# EasyEDA Pro project ProPrj_HEMY 2.0_2025-04-23.epro, schematic Schematic3_2
Board Name: DC & USB Dovetail; Create Date: 2025-03-09; Page Name: P1; Project Name: AstraNode; Schematic Name: Schematic3_2; Update Date: 2025-03-09; Company: EasyEDA.com; Page Size: A4; Version: V1.0
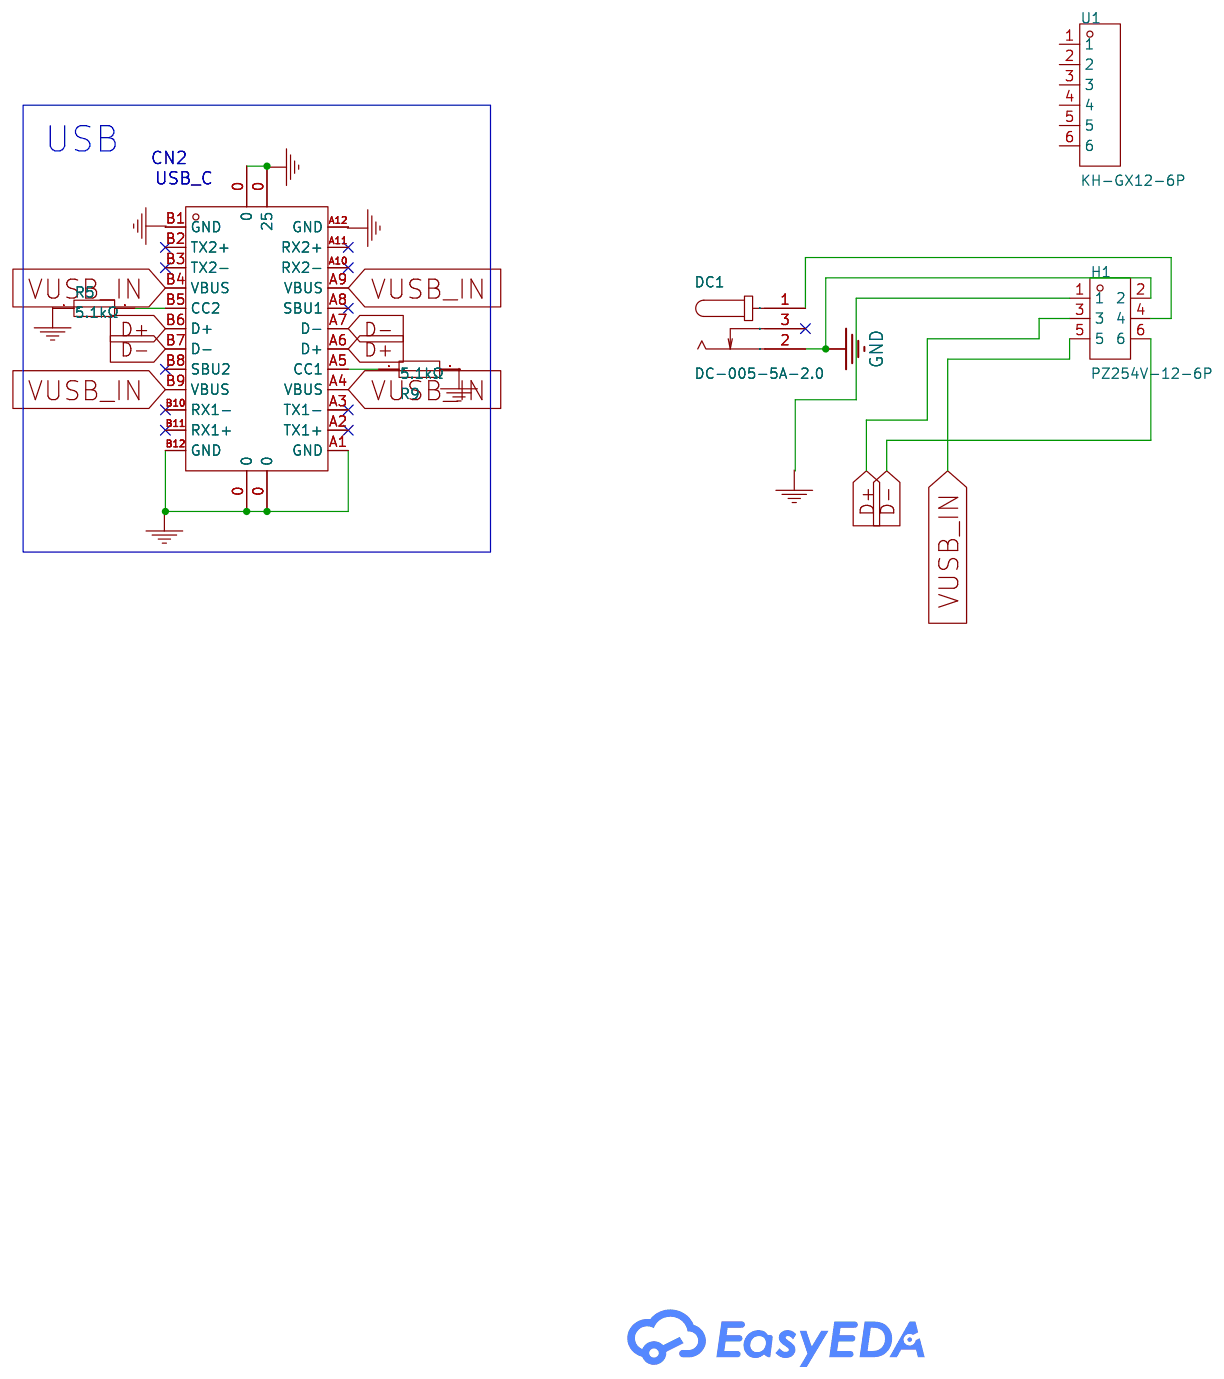
[diagram p4: schematic sheet]

## Parts
CN2  USB_C  [USB-C-SMD_TYPE-C-USB-18]
DC1  DC-005-5A-2.0  [DC-IN-TH_DC-005-5A-2.0]  (no BOM)
H1  PZ254V-12-6P  [HDR-TH_6P-P2.54-V-M-R2-C3-S2.54]  (no BOM)
R5  5.1kΩ  [R0603]
R9  5.1kΩ  [R0603]
U1  KH-GX12-6P  [CONN-TH_GX12-6P]  (no BOM)

## Library data of the parts
CN2 = USB_C: JLCPCB Part Class: ExtendedPart; link: https://item.szlcsc.com/145400.html; Manufacturer: MOLEX; Manufacturer Part: 105450-0101; Supplier: LCSC; Supplier Part: C134092; Check: true
DC1 = DC-005-5A-2.0: Connector Type:DC Power Receptacle Mounting Style:Bend insert Inside Contact Diameter:2mm Outside Contact Diameter:6.2mm Current Rating (Max):5A Voltage Rating (Max):24V Operating Temperature Range:-20℃~+70℃ Operating Temperature Range:-20℃~+70℃; LCSC Part Name: DC电源插座 内径:2mm 外径:6.2mm; Supplier Part: C381116; Manufacturer: XKB Connection(中国星坤); Supplier Footprint: 插件; JLCPCB Part Class: Extended Part; Datasheet: https://atta.szlcsc.com/upload/public/pdf/source/20211015/707A35F7AB6E89C57AAB641950105BB7.pdf; Supplier: LCSC; Connector Type: DC Power Receptacle; Mounting Style: Bend insert; Inside Contact Diameter: 2mm; Outside Contact Diameter: 6.2mm; Current Rating (Max): 5A; Voltage Rating (Max): 24V; Operating Temperature Range: -20℃~+70℃
H1 = PZ254V-12-6P: Pin Structure:2x3P Pitch:2.54mm Row Spacing:2.54mm Circluar Pins/Square Pins:Square Pins Mounting Type:Straight Number of Rows:双排 Number of Pins:6P Current Rating (Max):- Voltage Rating (Max):- Length of Mating Pin:6mm Insulation Height:2.5mm Length of En; LCSC Part Name: 间距:2.54mm 2x3P 直插 方针; Supplier Part: C492420; Manufacturer: XFCN(兴飞); Supplier Footprint: 插件,P=2.54mm; JLCPCB Part Class: Extended Part; Datasheet: https://atta.szlcsc.com/upload/public/pdf/source/20200309/C492420_BAECB307B001054C09D200388220EAE6.pdf; Supplier: LCSC; Pin Structure: 2x3P; Pitch: 2.54mm; Row Spacing: 2.54mm; Circluar Pins/Square Pins: Square Pins; Mounting Type: Straight; Number of Rows: 双排; Number of Pins: 6P; Length of Mating Pin: 6mm; Insulation Height: 2.5mm; Length of End Connection Pin: 3mm; Operating Temperature Range: -40℃~+105℃; Color: Black
R5 R9 = 0603WAF5101T5E: Type:Thick Film Resistors Resistance:5.1kΩ Tolerance:±1% Tolerance:±1% Power(Watts): Overload Voltage (Max): Temperature Coefficient:±100ppm/℃ Temperature Coefficient:±100ppm/℃ Operating Temperature Range:-55℃~+155℃ Operating Temperature Range:-55℃~+155℃; LCSC Part Name: 5.1kΩ ±1% 100mW 厚膜电阻; Supplier Part: C23186; Manufacturer: UNI-ROYAL(厚声); Supplier Footprint: 0603; JLCPCB Part Class: Basic Part; Datasheet: https://atta.szlcsc.com/upload/public/pdf/source/20200306/C422600_1E6D84923E4A46A82E41ADD87F860B5C.pdf; Supplier: LCSC; Type: Thick Film Resistors; Tolerance: ±1%; Temperature Coefficient: ±100ppm/℃; Operating Temperature Range: -55℃~+155℃; Check: true
U1 = KH-GX12-6P: Socket Specification:M12 Number of Pins:6P Gender:公母一套 Angle:直头 Coding Scheme:- Level of Protection:- Current Rating (Max):5A Rated Voltage (Max):125V Contact Material:- Contact Plating:- Operating Temperature Range:-20℃~+85℃ Operating Temperature Range:-; LCSC Part Name: 2件套; Supplier Part: C18203264; Manufacturer: kinghelm(金航标); JLCPCB Part Class: Extended Part; Datasheet: https://atta.szlcsc.com/upload/public/pdf/source/20230927/54C8C016C9BD795CB5C7B9261DE17A1E.pdf; Supplier: LCSC; Socket Specification: M12; Number of Pins: 6P; Gender: 公母一套; Angle: 直头; Current Rating (Max): 5A; Rated Voltage (Max): 125V; Operating Temperature Range: -20℃~+85℃

## Nets
GND: CN2.0 CN2.A1(GND) CN2.A12(GND) CN2.B1(GND) CN2.B12(GND) DC1.2 H1.1 H1.2 R5.1 R9.2
D+: CN2.A6(D+) CN2.B6(D+) H1.3
D-: CN2.A7(D-) CN2.B7(D-) H1.6
VUSB_IN: CN2.A4(VBUS) CN2.A9(VBUS) CN2.B4(VBUS) CN2.B9(VBUS) H1.5
$1N564: DC1.1 H1.4
$1N1653: CN2.B5(CC2) R5.2
$1N1655: CN2.A5(CC1) R9.1

Not connected (* = marked no-connect by the designer): CN2 A2(TX1+)* A3(TX1-)* A8(SBU1)* A10(RX2-)* A11(RX2+)* B2(TX2+)* B3(TX2-)* B8(SBU2)* B10(RX1-)* B11(RX1+)*; DC1 3*; U1 1 2 3 4 5 6

## Notes on the sheet
- USB
